# Altium schematic sheet Photodiode.SchDoc
size 420 x 297 mm; Address1: Address1; Address2: Address2; Address3: Address3; Address4: Address4; DocumentNumber: *Э3; SheetNumber: 2; SheetTotal: 10; DocumentType: Схема электрическая *
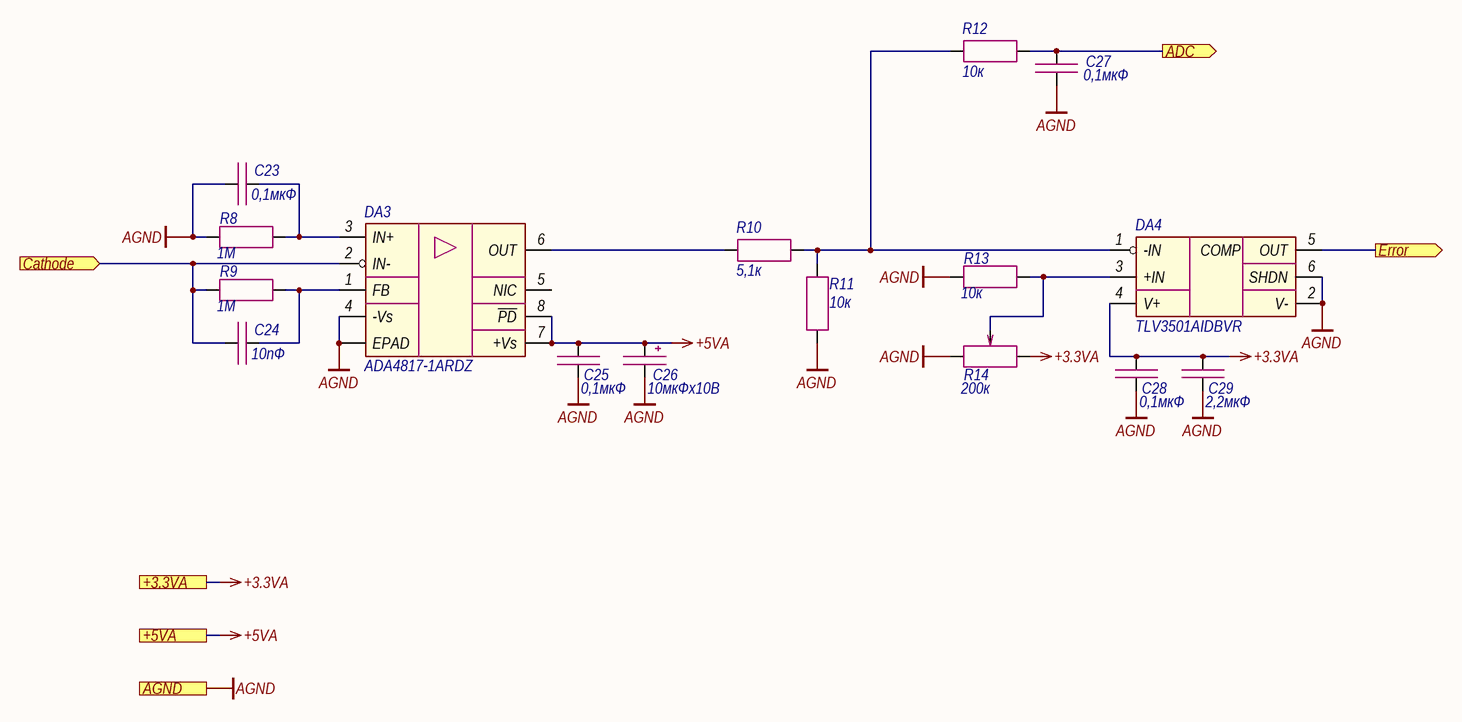
[diagram p0: Photodiode.SchDoc]

## Parts
C23  0,1мкФ  [CAP_0603]
C24  10пФ  [CAP_0603]
C25  0,1мкФ  [CAP_0603]
C26  10мкФх10B  [CAP_A]
C27  0,1мкФ  [CAP_0603]
C28  0,1мкФ  [CAP_0603]
C29  2,2мкФ  [CAP_0603]
DA3  ADA4817-1ARDZ  [SOIC-8 EPAD]
DA4  TLV3501AIDBVR  [SOT-23-6]
R8  1М  [RES_0805]
R9  1М  [RES_0805]
R10  5,1к  [RES_0603]
R11  10к  [RES_0603]
R12  10к  [RES_0603]
R13  10к  [RES_0603]
R14  200к  [3224W]

## Ports
+3.3VA (see Main[2A], Hardwiring[4D], Thermistor[2C]), +5VA (see Main[1A]), ADC (out, see Main[2A]), AGND (see Main[1A], Hardwiring[4D], Thermistor[2C]), Cathode (in, see Main[1A]), Error (out, see Main[2A])

## Nets
+3.3VA: C28.1 C29.1 DA4.4(V+) R14.3 ; port +3.3VA
+5VA: C25.1 C26.1 DA3.7(+Vs) DA3.8(~{PD}) ; port +5VA
AGND: C23.1 C25.2 C26.2 C27.2 C28.2 C29.2 DA3.4(-Vs) DA3.EPAD DA4.2(V-) DA4.6(SHDN) R8.2 R11.2 R13.1 R14.1 ; port AGND
ADC: C27.1 R12.2 ; port ADC
Cathode: C24.2 DA3.2(IN-) R9.2 ; port Cathode
Error: DA4.5(OUT) ; port Error
NetC23_2: C23.2 DA3.3(IN+) R8.1
NetC24_1: C24.1 DA3.1(FB) R9.1
NetDA3_6: DA3.6(OUT) R10.1
NetDA4_1: DA4.1(-IN) R10.2 R11.1 R12.1
NetDA4_3: DA4.3(+IN) R13.2 R14.2

Not connected (* = marked no-connect by the designer): DA3 5(NIC)

## Notes on the sheet
- Подп. и дата
- Инв. № дубл.
- Взам. инв. №
- Инв. № подл.
- Изм.
- Лист
- № докум.
- Подп.
- Дата
- Копировал
- Формат А3
- (in symbol TLV3501) COMP

## Library data of the parts
C23 C25 C27 C28 = Capacitor: Manufacturer: Murata; Model: GRM188R71H104KA93D; Value: 0,1мкФ; Document: *
C24 = Capacitor: Manufacturer: Murata; Model: GRM1885C1H100JA01D; Value: 10пФ; Document: *
C26 = Capacitor_Polar: Model: TECAP, 10 мкФ, 10 В, тип A, 10%; Value: 10мкФх10B; Document: *; Manufacturer: *
C29 = Capacitor: Manufacturer: Murata; Model: GRM188R61H225KE11D; Value: 2,2мкФ; Document: *
DA3 = ADA4817-1ARDZ: Manufacturer: Analog Devices; Model: ADA4817-1ARDZ; Document: *
DA4 = TLV3501: Manufacturer: Texas Instruments; Model: TLV3501AIDBVR; Document: *
R8 R9 = Resistor: Manufacturer: Yageo; Model: RC0805FR-071ML; Value: 1М; Document: *
R10 = Resistor: Manufacturer: Yageo; Model: RC0603FR-075K1L; Value: 5,1к; Document: *
R11-R13 = Resistor: Manufacturer: Yageo; Model: RC0603FR-0710KL; Value: 10к; Document: *
R14 = Resistor_Variable: Manufacturer: Bourns; Model: 3224W-1-204E; Value: 200к; Document: *